# Altium schematic sheet 01_ESP-CAM.SchDoc: ESP-EYE
size 840 x 594 mm; Page Create Date: March  8, 1995; Page Number: 1; Page Size: A1; Page Count: 1; RevCode: 2.1; DsnPath: D:\GH0050\prj\pcb\Others\esp32\CAM3\ESP-CAM_V28.DSN; SchematicName: SCHEMATIC1; PageName: 01_ESP-CAM; PageSize: A1; TopSchematic: True
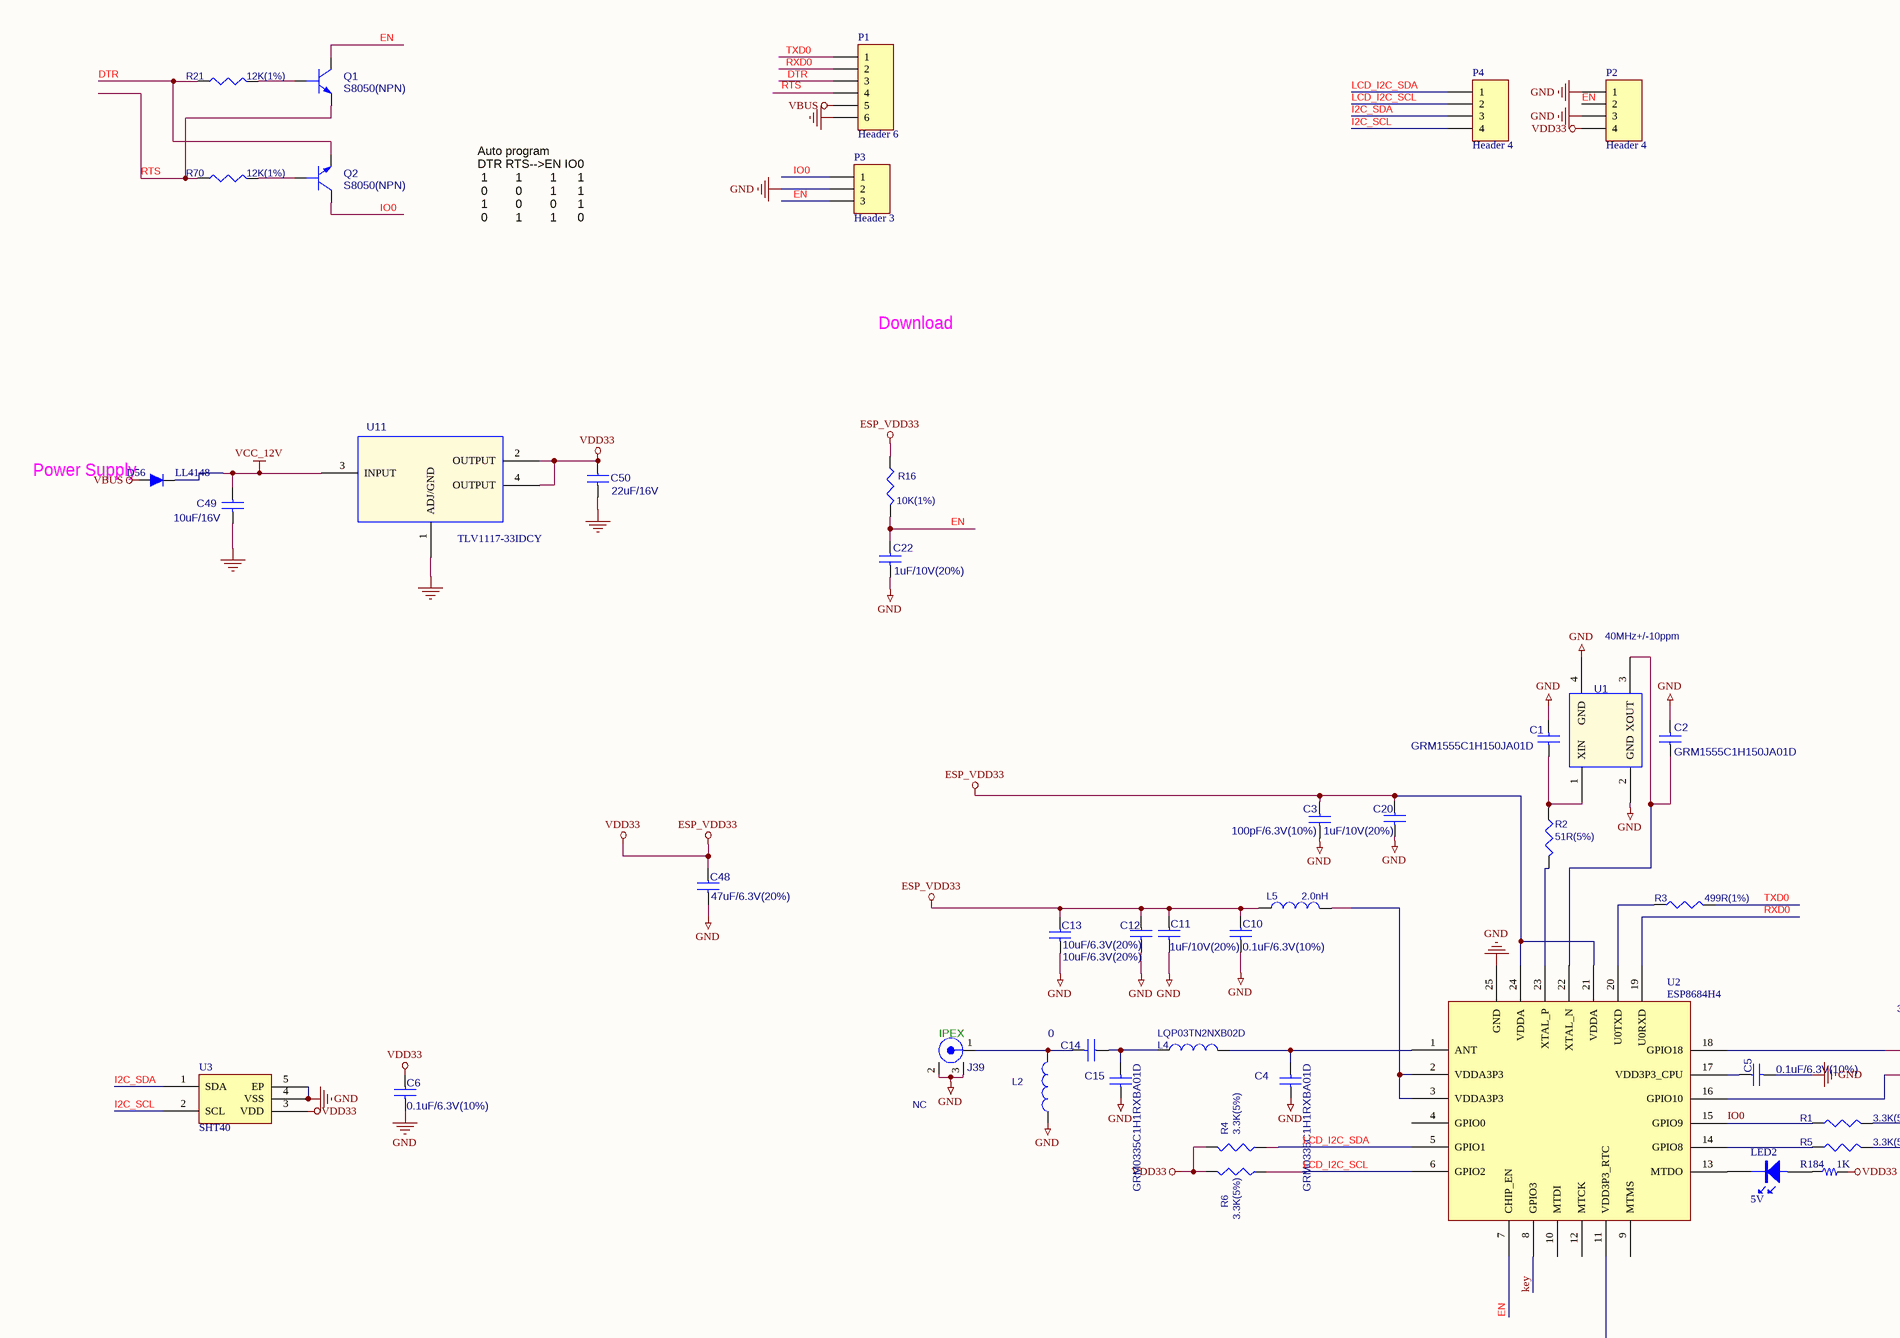
[diagram p0: 01_ESP-CAM.SchDoc, top left]
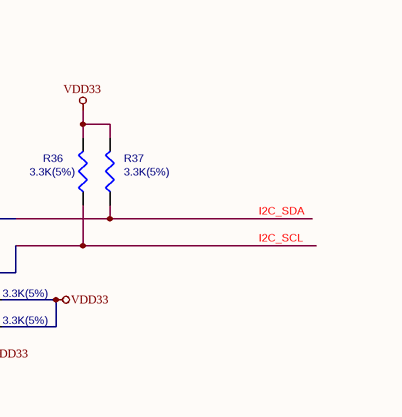
[diagram p1: 01_ESP-CAM.SchDoc, top right]
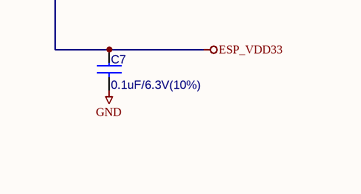
[diagram p2: 01_ESP-CAM.SchDoc, bottom left]
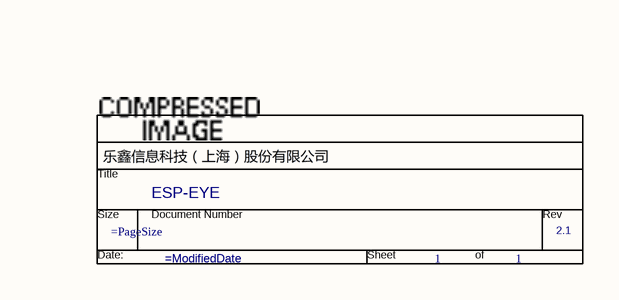
[diagram p3: 01_ESP-CAM.SchDoc, bottom right]

## Parts
*  RevCode: 2.1  Title: ESP-EYE  Page Number: 1  (graphical)
C1  value GRM1555C1H150JA01D  [0402C]  (hidden comment: CAP NP_Dup1)
C2  value GRM1555C1H150JA01D  [0402C]  (hidden comment: CAP NP_Dup1)
C3  value 100pF/6.3V(10%)  [0402C]  (hidden comment: CAP NP_Dup1)
C4  value GRM0335C1H1RXBA01D  [0402C]  (hidden comment: CAP NP_Dup1)
C5  value 0.1uF/6.3V(10%)  [0402C]  (hidden comment: CAP NP_Dup1)
C6  value 0.1uF/6.3V(10%)  [0402C]  (hidden comment: CAP NP_Dup1)
C7  value 0.1uF/6.3V(10%)  [0402C]  (hidden comment: CAP NP_Dup1)
C10  value 0.1uF/6.3V(10%)  [0402C]  (hidden comment: CAP NP_Dup1)
C11  value 1uF/10V(20%)  [0402C]  (hidden comment: CAP NP_Dup1)
C12  value 10uF/6.3V(20%)  [0402C]  (hidden comment: CAP NP_Dup1)
C13  value 10uF/6.3V(20%)  [0402C]  (hidden comment: CAP NP_Dup1)
C14  value 0  [0402C]  (hidden comment: CAP NP_Dup1)
C15  value GRM0335C1H1RXBA01D  [0402C]  (hidden comment: CAP NP_Dup1)
C20  value 1uF/10V(20%)  [0402C]  (hidden comment: CAP NP_Dup1)
C22  value 1uF/10V(20%)  [0402C]  (hidden comment: CAP NP_Dup1)
C48  value 47uF/6.3V(20%)  [1206C]  (hidden comment: CAP NP_Dup1)
C49  value 10uF/16V  [0603C]  (hidden comment: CAP NP)
C50  value 22uF/16V  [1206C]  (hidden comment: CAP NP)
D56  LL4148  [sod123]
J39  value IPEX  [IPEX-SMD_BWIPX-1-001E]  (hidden comment: IPEX_0)
L2  value NC  [0402R]  (hidden comment: CHOKE)
L4  value LQP03TN2NXB02D  [0402R]  (hidden comment: CHOKE)
L5  value 2.0nH  [0402R]  (hidden comment: CHOKE)
LED2  5V  [0603LED]
P1  Header 6  [HDR1X6]
P2  Header 4  [1.27-4P]
P3  Header 3  [HDR1X3]
P4  Header 4  [1.27-4P]
Q1  value S8050(NPN)  [SOT23-3]  (hidden comment: NPN BCE_2)
Q2  value S8050(NPN)  [SOT23-3]  (hidden comment: NPN BCE_2)
R1  value 3.3K(5%)  [0402R]  (hidden comment: RESISTOR_0)
R2  value 51R(5%)  [0402R]  (hidden comment: RESISTOR)
R3  value 499R(1%)  [0402R]  (hidden comment: RESISTOR)
R4  value 3.3K(5%)  [0402R]  (hidden comment: RESISTOR_0)
R5  value 3.3K(5%)  [0402R]  (hidden comment: RESISTOR_0)
R6  value 3.3K(5%)  [0402R]  (hidden comment: RESISTOR_0)
R16  value 10K(1%)  [0402R]  (hidden comment: RESISTOR_0)
R21  value 12K(1%)  [0402R]  (hidden comment: RESISTOR_0)
R36  value 3.3K(5%)  [0402R]  (hidden comment: RESISTOR_0)
R37  value 3.3K(5%)  [0402R]  (hidden comment: RESISTOR_0)
R70  value 12K(1%)  [0402R]  (hidden comment: RESISTOR_0)
R184  1K  [0603R]
U1  value 40MHz+/-10ppm  [XTAL4TN_3225]  (hidden comment: X1_1)
U2  ESP8684H4  [QFN24-MPU6000]
U3  SHT40  [SH30]
U11  value TLV1117-33IDCY  [SOT223]  (hidden comment: TLV1117)

## Nets
ESP_VDD33: C3.1 C6.1 C7.1 C10.1 C11.1 C12.1 C13.1 C20.1 C48.1 C50.1 L5.2 P2.4 R1.2 R4.2 R5.2 R6.2 R16.1 R36.2 R37.2 R184.2 U2.11(VDD3P3_RTC) U2.21(VDDA) U2.24(VDDA) U3.3(VDD) U11.2(OUTPUT) U11.4(OUTPUT)  [also labelled VDD33]
GND: C1.2 C2.2 C3.2 C4.1 C5.2 C6.2 C7.2 C10.2 C11.2 C12.2 C13.2 C15.1 C20.2 C22.2 C48.2 C49.2 C50.2 J39.2(GND1) J39.3(GND2) L2.2 P1.6 P2.1 P2.3 P3.2 U1.2(GND) U1.4(GND) U2.25(GND) U3.4(VSS) U3.5(EP) U11.1(ADJ/GND)
VBUS: D56.2 P1.5
VCC_12V: C49.1 D56.1 U11.3(INPUT)
DTR: P1.3 Q2.2(E) R21.1
EN: C22.1 P2.2 P3.3 Q1.3(C) R16.2 U2.7(CHIP_EN)
I2C_SCL: P4.4 R36.1 U2.16(GPIO10) U3.2(SCL)
I2C_SDA: P4.3 R37.1 U2.18(GPIO18) U3.1(SDA)
IO0: P3.1 Q2.3(C) R1.1 U2.15(GPIO9)
key: U2.8(GPIO3)
LCD_I2C_SCL: P4.2 R6.1 U2.6(GPIO2)
LCD_I2C_SDA: P4.1 R4.1 U2.5(GPIO1)
RTS: Q1.2(E) R70.1
RXD0: P1.2 U2.19(U0RXD)
TXD0: P1.1 R3.2
NetC1_1: C1.1 R2.1 U1.1(XIN)
NetC2_1: C2.1 U1.3(XOUT) U2.22(XTAL_N)
NetC4_2: C4.2 L4.1 U2.1(ANT)
NetC5_1: C5.1 U2.17(VDD3P3_CPU)
NetC14_1: C14.1 C15.2 L4.2
NetC14_2: C14.2 J39.1(RF) L2.1
NetL5_1: L5.1 U2.2(VDDA3P3) U2.3(VDDA3P3)
NetLED2_1: LED2.1 R184.1
NetLED2_2: LED2.2 U2.13(MTDO)
NetQ1_1: Q1.1(B) R21.2
NetQ2_1: Q2.1(B) R70.2
NetR2_2: R2.2 U2.23(XTAL_P)
NetR3_1: R3.1 U2.20(U0TXD)
NetR5_1: R5.1 U2.14(GPIO8)

Not connected (* = marked no-connect by the designer): P1 4; U2 4(GPIO0) 9(MTMS) 10(MTDI) 12(MTCK)

## Notes on the sheet
- Auto program
  DTR RTS-->EN IO0
  1        1        1      1
  0        0        1      1
  1        0        0      1
  0        1        1      0
- Download
- (near D56) Power Supply
- Labels drawn without touching a wire or pin: RTS
- (in symbol espTitleBlock1) Title; Size; Document Number; Rev; Date:; Sheet; of

## Library data of the parts
* = espTitleBlock1: Page Create Date: March  8, 1995; Page Size: =PageSize; Page Count: 1; Page Modify Date: =ModifiedDate
C1 = CAP NP_Dup1: Part Reference: C1; PCB Footprint: C0402
C2 = CAP NP_Dup1: Part Reference: C2; PCB Footprint: C0402
C3 = CAP NP_Dup1: Part Reference: C3; PCB Footprint: C0402
C4 C15 = CAP NP_Dup1: Part Reference: C15; PCB Footprint: C0402
C5-C7 C10 = CAP NP_Dup1: Part Reference: C10; PCB Footprint: C0402
C11 = CAP NP_Dup1: Part Reference: C11; PCB Footprint: C0402
C12 = CAP NP_Dup1: Part Reference: C12; PCB Footprint: C0402
C13 = CAP NP_Dup1: Part Reference: C13; PCB Footprint: C0402
C14 = CAP NP_Dup1: Part Reference: C14; PCB Footprint: C0402
C20 = CAP NP_Dup1: Part Reference: C20; PCB Footprint: C0402
C22 = CAP NP_Dup1: Part Reference: C22; PCB Footprint: C0402
C48 = CAP NP_Dup1: Part Reference: C48; PCB Footprint: C1206
C49 = CAP NP: Part Reference: C49; PCB Footprint: C0603
C50 = CAP NP: Part Reference: C50; PCB Footprint: C1206
D56 = LL4148: VISHAY,LL4148,圆柱体MiniMELF100V/2A,ROHS; 版本: V1.00; 名称: 快速开关二极管; 物料编号: APLLY; 制造商: VISHAY
J39 = IPEX_0: Part Reference: J39; PCB Footprint: ect8180001581
L2 L4 = CHOKE: Part Reference: L4; PCB Footprint: R0402
L5 = CHOKE: Part Reference: L5; PCB Footprint: R0402
LED2 = LED
P1 = Header 6: Header, 6-Pin; LatestRevisionDate: 17-Jul-2002; LatestRevisionNote: Re-released for DXP Platform.; Publisher: Altium Limited
P2 P4 = Header 4: Header, 4-Pin; LatestRevisionDate: 17-Jul-2002; LatestRevisionNote: Re-released for DXP Platform.; Publisher: Altium Limited
P3 = Header 3: Header, 3-Pin; LatestRevisionDate: 17-Jul-2002; LatestRevisionNote: Re-released for DXP Platform.; Publisher: Altium Limited
Q1 = NPN BCE_2: Part Reference: Q1; PspiceTemplate: Q^@REFDES %C %B %E; PCB Footprint: SOT23-3
Q2 = NPN BCE_2: Part Reference: Q2; PspiceTemplate: Q^@REFDES %C %B %E; PCB Footprint: SOT23-3
R1 R5 R6 R36 = RESISTOR_0: Part Reference: R36; PCB Footprint: R0402; SIGNAL_MODEL: DEFAULT_RESISTOR_200OHM_1_2
R2 = RESISTOR: Part Reference: R2; PCB Footprint: R0402
R3 = RESISTOR: Part Reference: R3; PCB Footprint: R0402
R4 R37 = RESISTOR_0: Part Reference: R37; PCB Footprint: R0402; SIGNAL_MODEL: DEFAULT_RESISTOR_200OHM_1_2
R16 = RESISTOR_0: Part Reference: R16; PCB Footprint: R0402; SIGNAL_MODEL: DEFAULT_RESISTOR_10000OHM_1_2
R21 = RESISTOR_0: Part Reference: R21; SIGNAL_MODEL: DEFAULT_RESISTOR_200OHM_1_2; PCB Footprint: R0402
R70 = RESISTOR_0: Part Reference: R70; SIGNAL_MODEL: DEFAULT_RESISTOR_200OHM_1_2; PCB Footprint: R0402
R184 = R
U1 = X1_1: Part Reference: U1; PCB Footprint: CRY_3225
U11 = TLV1117-33IDCY: Part Reference: U11; PCB Footprint: SOT223